# EAGLE design untitled (EAGLE 8.5.2)
ESP Devkit-C Shield
CNAME: ESP32-DEVKIT SHIELD DESIGN; CREVISION: 1.0; DESIGNER: EREN MERT IREZ
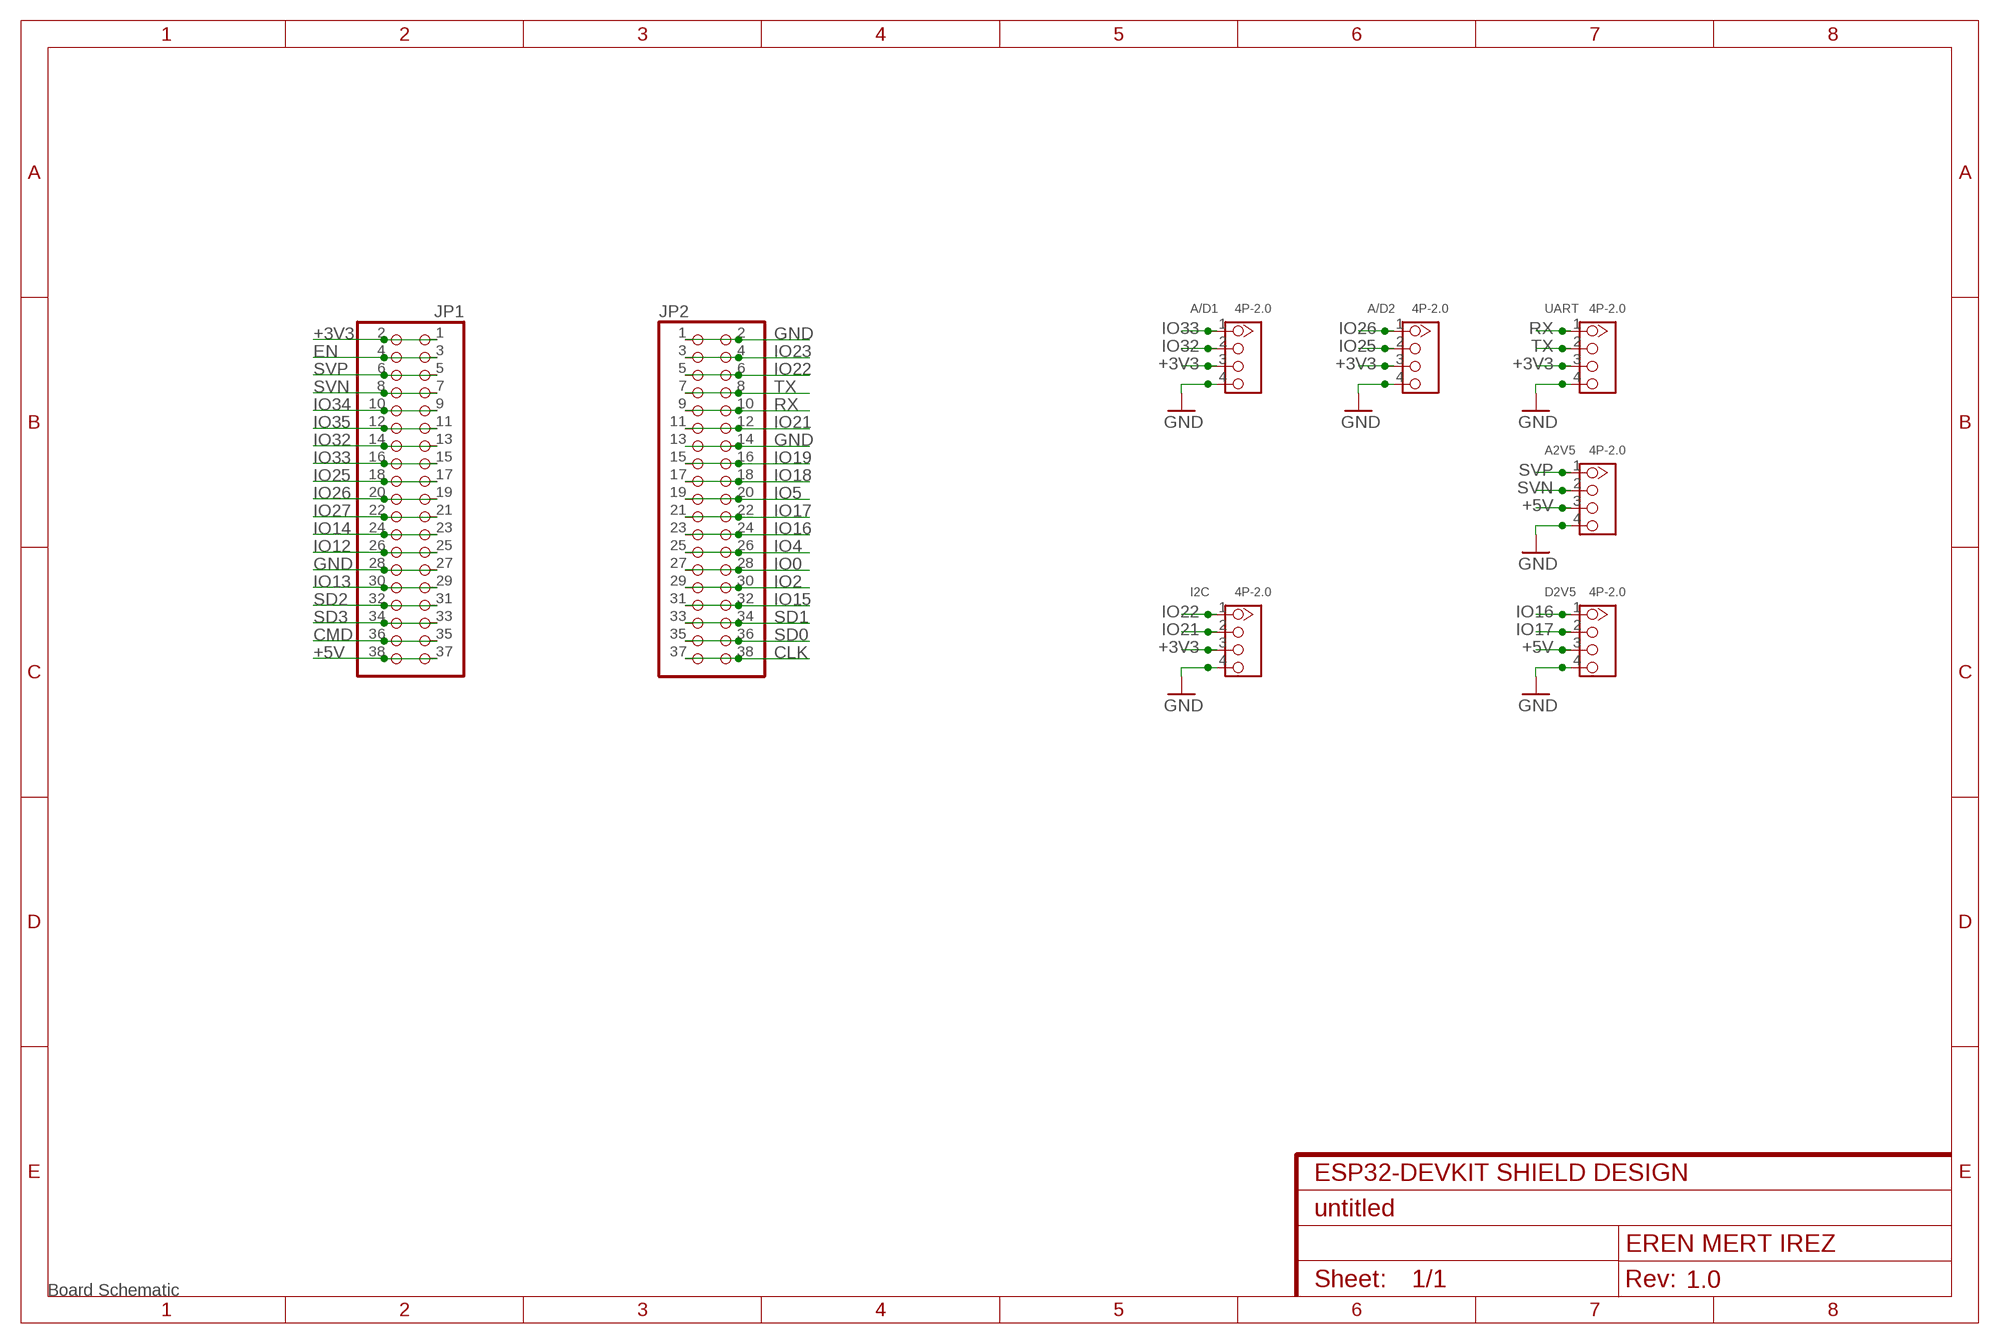
[diagram p0: schematic, sheet 1]
FRAME1 (FRAME-A4L): UNTITLED: Board Schematic

## Parts
A2V5  4P-2.0  GROVE-CONNECTOR-DIP(4P-2.0)  [HW4-2.0]
A/D1  4P-2.0  GROVE-CONNECTOR-DIP(4P-2.0)  [HW4-2.0]
A/D2  4P-2.0  GROVE-CONNECTOR-DIP(4P-2.0)  [HW4-2.0]
D2V5  4P-2.0  GROVE-CONNECTOR-DIP(4P-2.0)  [HW4-2.0]
I2C  4P-2.0  GROVE-CONNECTOR-DIP(4P-2.0)  [HW4-2.0]
JP1  PINHD-2X19  [2X19]
JP2  PINHD-2X19  [2X19]
UART  4P-2.0  GROVE-CONNECTOR-DIP(4P-2.0)  [HW4-2.0]

## Nets
+3V3: A/D1.3 A/D2.3 I2C.3 JP1.1 JP1.2 UART.3
+5V: A2V5.3 D2V5.3 JP1.37 JP1.38
CLK: JP2.37 JP2.38
CMD: JP1.35 JP1.36
EN: JP1.3 JP1.4
GND: A2V5.4 A/D1.4 A/D2.4 D2V5.4 I2C.4 JP1.27 JP1.28 JP2.1 JP2.2 JP2.13 JP2.14 UART.4
IO0: JP2.27 JP2.28
IO2: JP2.29 JP2.30
IO4: JP2.25 JP2.26
IO5: JP2.19 JP2.20
IO12: JP1.25 JP1.26
IO13: JP1.29 JP1.30
IO14: JP1.23 JP1.24
IO15: JP2.31 JP2.32
IO16: D2V5.1 JP2.23 JP2.24
IO17: D2V5.2 JP2.21 JP2.22
IO18: JP2.17 JP2.18
IO19: JP2.15 JP2.16
IO21: I2C.2 JP2.11 JP2.12
IO22: I2C.1 JP2.5 JP2.6
IO23: JP2.3 JP2.4
IO25: A/D2.2 JP1.17 JP1.18
IO26: A/D2.1 JP1.19 JP1.20
IO27: JP1.21 JP1.22
IO32: A/D1.2 JP1.13 JP1.14
IO33: A/D1.1 JP1.15 JP1.16
IO34: JP1.9 JP1.10
IO35: JP1.11 JP1.12
RX: JP2.9 JP2.10 UART.1
SD0: JP2.35 JP2.36
SD1: JP2.33 JP2.34
SD2: JP1.31 JP1.32
SD3: JP1.33 JP1.34
SVN: A2V5.2 JP1.7 JP1.8
SVP: A2V5.1 JP1.5 JP1.6
TX: JP2.7 JP2.8 UART.2

## Library data of the parts
A2V5 A/D1 A/D2 D2V5 I2C UART = Seeed-Connector -2016:GROVE-CONNECTOR-DIP(4P-2.0): 320110033
JP1 JP2 = pinhead:PINHD-2X19: PIN HEADER

## Board
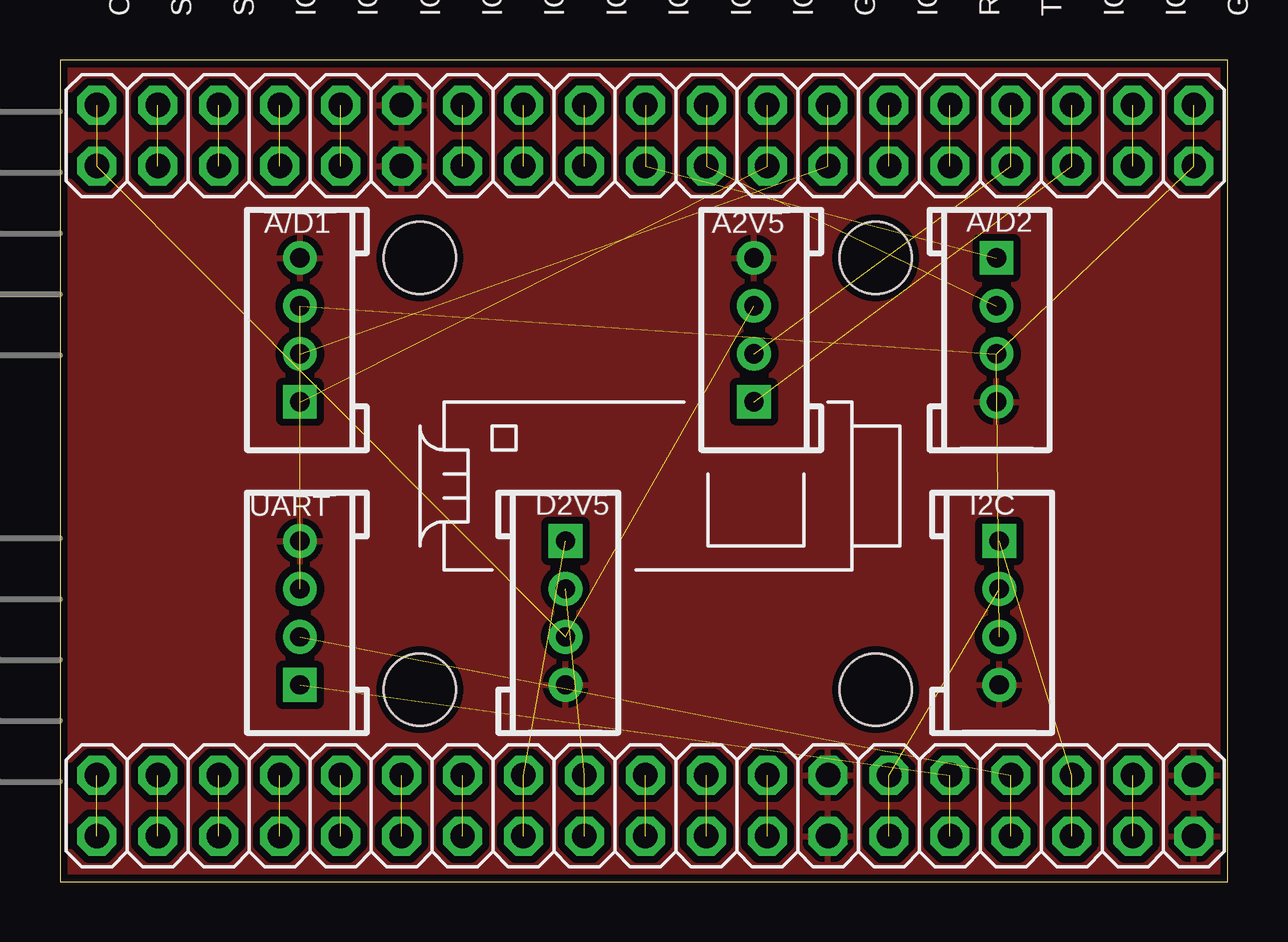
[diagram p1: board, top side]
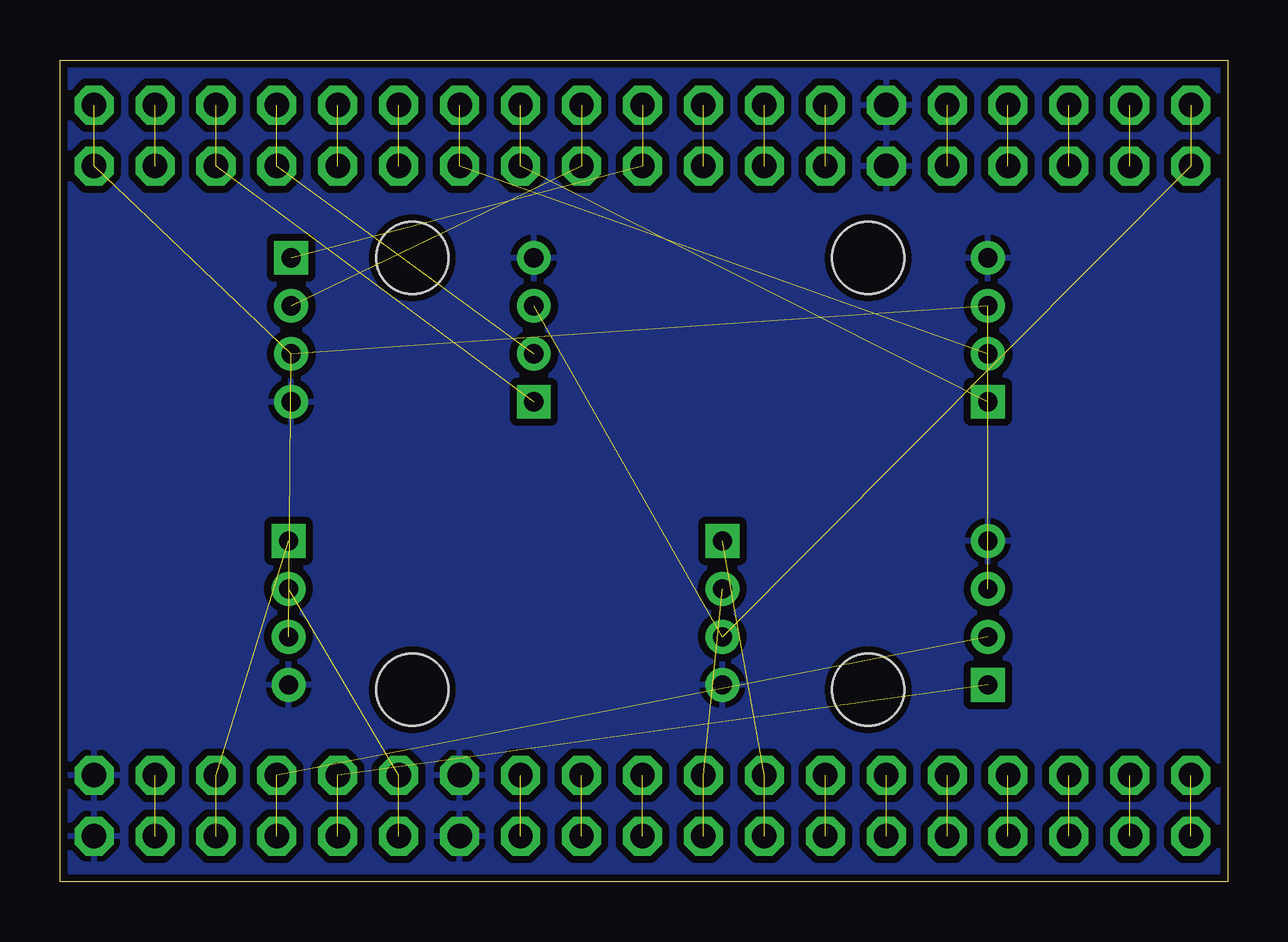
[diagram p2: board, bottom side, seen from below]

Size 48.68 x 34.25 mm. Coordinates in mm from the lower left corner, seen from the top.
Outline: 0,0 48.68,0 48.68,34.25 0,34.25 0,0
Copper layers (1*16): Top 0.035mm / dielectric 1.5mm / Bottom 0.035mm
Design rules "SparkFun": minimum track width 8mil, minimum drill 20mil, track to track 8mil, track to pad 8mil, pad to pad 8mil, via to via 8mil, smd to smd 8mil, copper to edge 8mil, drill to drill 8mil, minimum pad ring 12mil, minimum via ring 10mil, stop-mask expansion 4mil, vias tented up to drill 20mil, thermal gap 10mil
Holes 3 mm at 15,26 34,26 34,8 15,8

### Footprints (pad centres in the part's own frame; a part is rotated, then mirrored left to right if it is on the bottom)
HW4-2.0 = drill 0.8 pad 1.27 square: 1 -3,0 | drill 0.8 pad 1.27: 2 -1,0; 3 1,0; 4 3,0
2X19 = drill 1.016 octagon: 1 -22.86,-1.27; 2 -22.86,1.27; 3 -20.32,-1.27; 4 -20.32,1.27; 5 -17.78,-1.27; 6 -17.78,1.27; 7 -15.24,-1.27; 8 -15.24,1.27; 9 -12.7,-1.27; 10 -12.7,1.27; 11 -10.16,-1.27; 12 -10.16,1.27; 13 -7.62,-1.27; 14 -7.62,1.27; 15 -5.08,-1.27; 16 -5.08,1.27; 17 -2.54,-1.27; 18 -2.54,1.27; 19 0,-1.27; 20 0,1.27; 21 2.54,-1.27; 22 2.54,1.27; 23 5.08,-1.27; 24 5.08,1.27; 25 7.62,-1.27; 26 7.62,1.27; 27 10.16,-1.27; 28 10.16,1.27; 29 12.7,-1.27; 30 12.7,1.27; 31 15.24,-1.27; 32 15.24,1.27; 33 17.78,-1.27; 34 17.78,1.27; 35 20.32,-1.27; 36 20.32,1.27; 37 22.86,-1.27; 38 22.86,1.27

### Placement (x,y rotation side)
A2V5  28.93,23 90 top
A/D1  10,23 90 top
A/D2  39.04,23 270 top
D2V5  21.07,11.2 270 top
I2C  39.15,11.2 270 top
JP1  24.4,31.1 180 top
JP2  24.4,3.16 180 top
U$5  [BREADBOARD_SPACING]  -1.27,18.13 90 top
UART  10,11.2 90 top

### Tracks (layer width: path | path; a pad name or v marks a point on that pad's centre or on a via)
+3V3  (5 unrouted)
+5V  (3 unrouted)
CLK  (1 unrouted)
CMD  (1 unrouted)
EN  (1 unrouted)
GND
  pour Top (isolate 0.305): 0,34.26 0,0 49.01,0 49.01,34.26
  pour Bottom (isolate 0.305): 0,34.26 0,0 49.01,0 49.01,34.26
IO0  (1 unrouted)
IO2  (1 unrouted)
IO4  (1 unrouted)
IO5  (1 unrouted)
IO12  (1 unrouted)
IO13  (1 unrouted)
IO14  (1 unrouted)
IO15  (1 unrouted)
IO16  (2 unrouted)
IO17  (2 unrouted)
IO18  (1 unrouted)
IO19  (1 unrouted)
IO21  (2 unrouted)
IO22  (2 unrouted)
IO23  (1 unrouted)
IO25  (2 unrouted)
IO26  (2 unrouted)
IO27  (1 unrouted)
IO32  (2 unrouted)
IO33  (2 unrouted)
IO34  (1 unrouted)
IO35  (1 unrouted)
RX  (2 unrouted)
SD0  (1 unrouted)
SD1  (1 unrouted)
SD2  (1 unrouted)
SD3  (1 unrouted)
SVN  (2 unrouted)
SVP  (2 unrouted)
TX  (2 unrouted)

### Text on the board
tPlace: V5 / CMD / SD3 / SD2 / IO13 / GND / IO12 / IO14 / IO27 / IO26 / IO25 / IO33 / IO32 / IO35 / IO34 / SVN / SVP / EN / 3V3 | CLK / SD0 / SD1 / IO15 / IO2 / IO0 / IO4 / IO16 / IO17 / IO5 / IO18 / IO19 / GND / IO21 / RXD / TXD / IO22 / IO23 / GND | ThingForward
bPlace: Grove Base Shield / for ESP32-DevKitC / by ThingForward / www.thingforward.io